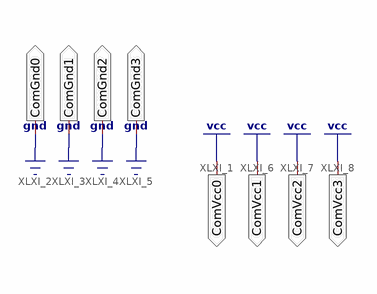
[diagram p0: schematic sheet 1]
// Xilinx ISE schematic commonset.sch (spartan6) as structural Verilog: 0 symbols, 8 ports
module commonset (
  output ComGnd0,
  output ComGnd1,
  output ComGnd2,
  output ComGnd3,
  output ComVcc0,
  output ComVcc1,
  output ComVcc2,
  output ComVcc3
);


  assign ComGnd0 = 1'b0;
  assign ComGnd1 = 1'b0;
  assign ComGnd2 = 1'b0;
  assign ComGnd3 = 1'b0;
  assign ComVcc0 = 1'b1;
  assign ComVcc1 = 1'b1;
  assign ComVcc2 = 1'b1;
  assign ComVcc3 = 1'b1;
endmodule
